# EAGLE design Psion Keyboard (EAGLE 8.7.0)
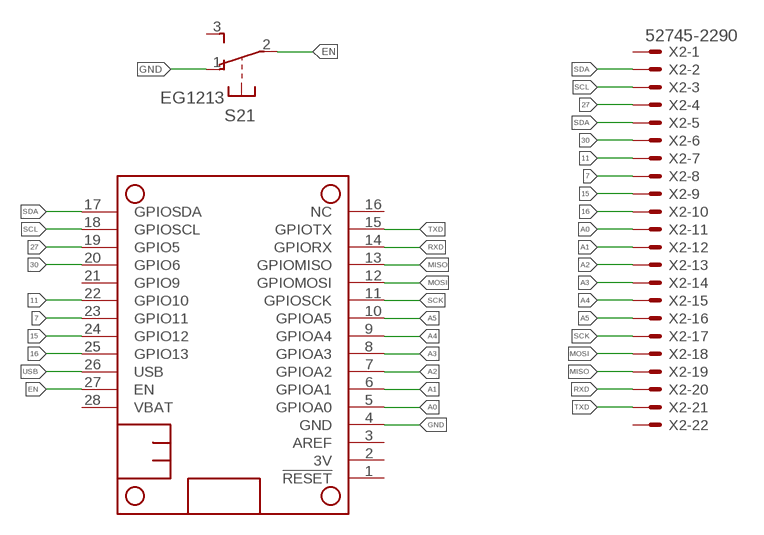
[diagram p0: schematic, sheet 1]

## Parts
MS1  FEATHERWING_NODIM  [FEATHERWING_DIM]
S2  EG1213  [EG1213]
X2  52745-2290  [52745-2290]

## Nets
7: MS1.23(GPIO11) X2.8
11: MS1.22(GPIO10) X2.7
15: MS1.24(GPIO12) X2.9
16: MS1.25(GPIO13) X2.10
27: MS1.19(GPIO5) X2.4
30: MS1.20(GPIO6) X2.6
A0: MS1.5(GPIOA0) X2.11
A1: MS1.6(GPIOA1) X2.12
A2: MS1.7(GPIOA2) X2.13
A3: MS1.8(GPIOA3) X2.14
A4: MS1.9(GPIOA4) X2.15
A5: MS1.10(GPIOA5) X2.16
EN: MS1.27(EN) S2.2(1:P)
GND: MS1.4(GND) S2.1(1:O)
MISO: MS1.13(GPIOMISO) X2.19
MOSI: MS1.12(GPIOMOSI) X2.18
RXD: MS1.14(GPIORX) X2.20
SCK: MS1.11(GPIOSCK) X2.17
SCL: MS1.18(GPIOSCL) X2.3
SDA: MS1.17(GPIOSDA) X2.2 X2.5
TXD: MS1.15(GPIOTX) X2.21
USB: MS1.26(USB)
Unconnected: MS1.1(!RESET) MS1.2(3V) MS1.3(AREF) MS1.16(NC) MS1.21(GPIO9) MS1.28(VBAT) S2.3(1:S) S2.MT1(MT) S2.MT2(MT) X2.1 X2.22

## Library data of the parts
MS1 = adafruit:FEATHERWING
S2 = adafruit:EG1213: E-Switch right-angle slide SPDT Part #EG1213 http://www.ladyada.net/library/eagle
X2 = con-molex:52745-2290: FFC/FPC-to-Board 0.50mm (.020") SMT Top Contact Right Angle, ZIF, Style Receptacle 52745 / 52435 Source: http://www.molex.com/product/ffc/52745.html; MF: MOLEX; OC_FARNELL: unknown; OC_NEWARK: unknown

## Board
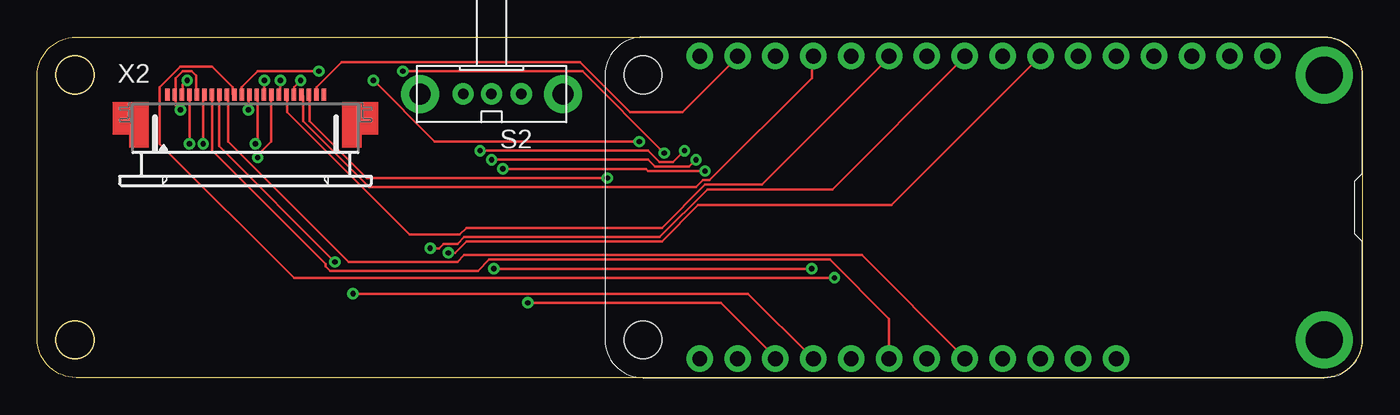
[diagram p1: board, top side]
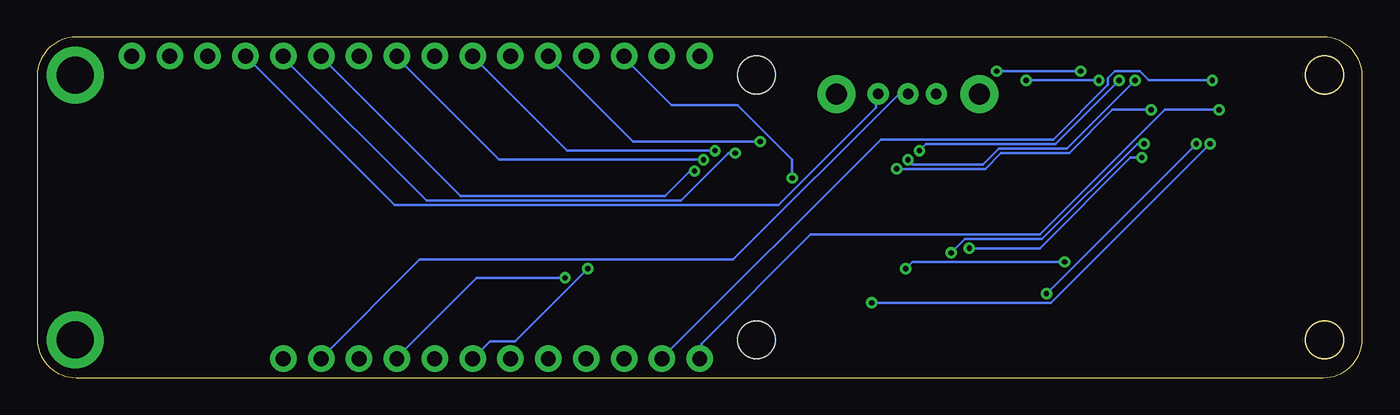
[diagram p2: board, bottom side, seen from below]

Size 88.9 x 22.86 mm. Coordinates in mm from the lower left corner, seen from the top.
Outline: 88.9,20.26 88.9,2.6 arc-90 86.3,0 2.6,0 arc-90 0,2.6 0,20.26 arc-90 2.6,22.86 86.3,22.86 arc-90 88.9,20.26
Outline: circle at 2.54,2.54 radius 1.27
Outline: circle at 2.54,20.32 radius 1.27
Copper layers (1*16): Top 0.035mm / dielectric 1.5mm / Bottom 0.035mm
Design rules "default": minimum track width 6mil, minimum drill 0.35mm, track to track 6mil, track to pad 6mil, pad to pad 6mil, via to via 6mil, smd to smd 6mil, copper to edge 40mil, drill to drill 6mil, minimum pad ring 10mil, minimum via ring 8mil, stop-mask expansion 4mil, vias tented up to drill 0mil, thermal gap 10mil
Holes 2.54 mm at 2.54,2.54 2.54,20.32

### Footprints (pad centres in the part's own frame; a part is rotated, then mirrored left to right if it is on the bottom)
FEATHERWING_DIM = drill 1 pad 1.778: 1 6.35,1.27; 2 8.89,1.27; 3 11.43,1.27; 4 13.97,1.27; 5 16.51,1.27; 6 19.05,1.27; 7 21.59,1.27; 8 24.13,1.27; 9 26.67,1.27; 10 29.21,1.27; 11 31.75,1.27; 12 34.29,1.27; 13 36.83,1.27; 14 39.37,1.27; 15 41.91,1.27; 16 44.45,1.27; 17 44.45,21.59; 18 41.91,21.59; 19 39.37,21.59; 20 36.83,21.59; 21 34.29,21.59; 22 31.75,21.59; 23 29.21,21.59; 24 26.67,21.59; 25 24.13,21.59; 26 21.59,21.59; 27 19.05,21.59; 28 16.51,21.59 | drill 2.5 pad 3.81: P$1 2.54,20.32; P$2 2.54,2.54 | hole 2.54: 48.26,20.32; 48.26,2.54
EG1213 = drill 0.7 pad 1.422: 1 -2,0; 2 0,0; 3 1.9,0 | drill 1.4 pad 2.54: MT1 -4.8,0; MT2 4.8,0
52745-2290 = smd 0.3 x 0.8: 1 -5.25,2.5; 2 -4.75,2.5; 3 -4.25,2.5; 4 -3.75,2.5; 5 -3.25,2.5; 6 -2.75,2.5; 7 -2.25,2.5; 8 -1.75,2.5; 9 -1.25,2.5; 10 -0.75,2.5; 11 -0.25,2.5; 12 0.25,2.5; 13 0.75,2.5; 14 1.25,2.5; 15 1.75,2.5; 16 2.25,2.5; 17 2.75,2.5; 18 3.25,2.5; 19 3.75,2.5; 20 4.25,2.5; 21 4.75,2.5; 22 5.25,2.5

### Placement (x,y rotation side)
MS1  88.9,22.86 180 top
S2  30.48,19.05 180 top
X2  13.97,16.51 0 top

### Tracks (layer width: path | path; a pad name or v marks a point on that pad's centre or on a via)
7  (via drill 0.35)
  Top 0.152: v19.96,7.77 12.19,15.54 12.19,18.9 X2.8 | v51.97,7.32 v30.63,7.32
  Bottom 0.152: v19.96,7.77 30.18,7.77 v30.63,7.32 | v51.97,7.32 56.84,2.44 58.52,2.44 MS1.23
11
  Top 0.152: MS1.22 57.15,3.96 53.19,7.92 30.33,7.92 29.57,7.16 19.66,7.16 19.36,7.47 19.36,7.62 11.73,15.24 11.73,18.9 X2.7
15
  Top 0.152: X2.9 12.8,18.9 12.8,15.85 20.88,7.77 28.19,7.77 28.65,8.23 55.32,8.23 62.18,1.37 MS1.24
16  (via drill 0.35)
  Top 0.152: v53.49,6.71 17.22,6.71 8.23,15.7 8.23,19.51 9.6,20.88 11.73,20.88 13.11,19.51 13.11,19.05 X2.10
  Bottom 0.152: v53.49,6.71 59.44,6.71 64.77,1.37 MS1.25
27  (via drill 0.35)
  Top 0.152: v10.21,15.7 10.21,18.9 X2.4 | v32.92,5.03 45.87,5.03 49.53,1.37 MS1.19
  Bottom 0.152: v10.21,15.7 20.88,5.03 v32.92,5.03
30  (via drill 0.35)
  Top 0.152: v11.12,15.7 11.12,18.9 X2.6 | v21.18,5.64 47.7,5.64 MS1.20
  Bottom 0.152: v21.18,5.64 v11.12,15.7
A0  (via drill 0.35)
  Top 0.152: v18.9,20.57 14.78,20.57 13.72,19.51 13.72,19.05 X2.11 | v24.54,20.57 36.58,20.57 v42.06,15.09
  Bottom 0.152: v24.54,20.57 v18.9,20.57 | v42.06,15.09 42.52,15.09 45.72,11.89 62.79,11.89 72.39,21.49 MS1.5
A1  (via drill 0.35)
  Top 0.152: v14.17,17.98 14.17,18.9 X2.12 | v31.24,14.02 40.84,14.02 41,13.87 v44.81,13.87
  Bottom 0.152: v14.17,17.98 16.76,17.98 19.66,15.09 24.23,15.09 25.3,14.02 v31.24,14.02 | v44.81,13.87 45.11,13.87 46.79,12.19 60.5,12.19 69.8,21.49 MS1.6
A2  (via drill 0.35)
  Top 0.152: v14.63,15.7 14.78,15.85 14.78,18.9 X2.13 | v27.58,8.38 28.04,8.38 28.8,9.14 41.91,9.14 44.35,11.58 57.3,11.58 MS1.7
  Bottom 0.152: v14.63,15.7 15.09,15.7 21.49,9.3 26.67,9.3 v27.58,8.38
A3  (via drill 0.35)
  Top 0.152: v15.24,19.96 15.24,19.05 X2.14 | v30.48,14.63 41,14.63 41.45,14.17 43.74,14.17 v44.2,14.63
  Bottom 0.152: v15.24,19.96 19.81,15.39 24.38,15.39 25.45,14.33 30.18,14.33 v30.48,14.63 | v44.2,14.63 57.91,14.63 64.77,21.49 MS1.8
A4  (via drill 0.35)
  Top 0.152: v14.78,14.78 14.78,14.94 15.7,15.85 15.7,18.9 X2.15 | v26.36,8.69 26.98,8.69 27.28,8.99 28.19,8.99 28.65,9.45 41.76,9.45 44.96,12.65 53.34,12.65 62.18,21.49 MS1.9
  Bottom 0.152: v14.78,14.78 15.54,14.78 21.64,8.69 v26.36,8.69
A5  (via drill 0.35)
  Top 0.152: v16.31,19.96 16.31,19.05 X2.16 | v29.72,15.24 41,15.24 41.76,14.48 42.67,14.48 v43.43,15.24
  Bottom 0.152: v16.31,19.96 20.57,15.7 29.26,15.7 v29.72,15.24 | v43.43,15.24 53.34,15.24 MS1.10
EN
  Bottom 0.152: S2.2 31.09,19.05 42.22,7.92 63.25,7.92 69.8,1.37 MS1.27
GND
  Bottom 0.152: MS1.4 64.92,11.58 39.17,11.58 32.61,18.14 32.61,19.05 S2.1
MISO
  Top 0.152: X2.19 17.83,18.9 17.83,17.22 22.25,12.8 44.2,12.8 44.65,13.26 45.11,13.26 51.97,20.12 51.97,21.49 MS1.13
MOSI  (via drill 0.35)
  Top 0.152: v17.68,19.96 17.22,19.51 17.22,19.05 X2.18 | v22.55,19.96 26.67,15.85 v40.39,15.85
  Bottom 0.152: v22.55,19.96 v17.68,19.96 | v40.39,15.85 48.92,15.85 54.56,21.49 MS1.12
RXD  (via drill 0.35)
  Top 0.152: v38.25,13.41 22.1,13.41 18.29,17.22 18.29,18.9 X2.20
  Bottom 0.152: v38.25,13.41 38.25,14.63 41.91,18.29 46.33,18.29 49.53,21.49 MS1.14
SCK
  Top 0.152: X2.17 16.76,18.9 16.76,17.83 24.99,9.6 28.35,9.6 28.8,10.06 41.91,10.06 44.81,12.95 48.62,12.95 57.15,21.49 MS1.11
SCL  (via drill 0.35)
  Top 0.152: v10.06,19.96 9.75,19.66 9.75,19.05 X2.3
  Bottom 0.152: v10.06,19.96 14.33,19.96 14.94,20.57 16.61,20.57 17.07,20.12 17.07,19.66 20.73,16 32.31,16 46.94,1.37 MS1.18
SDA  (via drill 0.35)
  Top 0.152: X2.5 10.67,19.05 10.67,20.27 10.36,20.57 9.75,20.57 9.3,20.12 9.3,19.05 X2.2 9.3,18.9 9.3,18.29 v9.6,17.98
  Bottom 0.152: v9.6,17.98 13.26,17.98 21.64,9.6 37.03,9.6 44.35,2.29 44.35,1.37 MS1.17
TXD
  Top 0.152: X2.21 18.75,19.05 18.75,19.51 20.42,21.18 36.42,21.18 39.78,17.83 43.28,17.83 46.94,21.49 MS1.15